# Altium schematic sheet 四缸机.SchDoc
size 459 x 379 mm
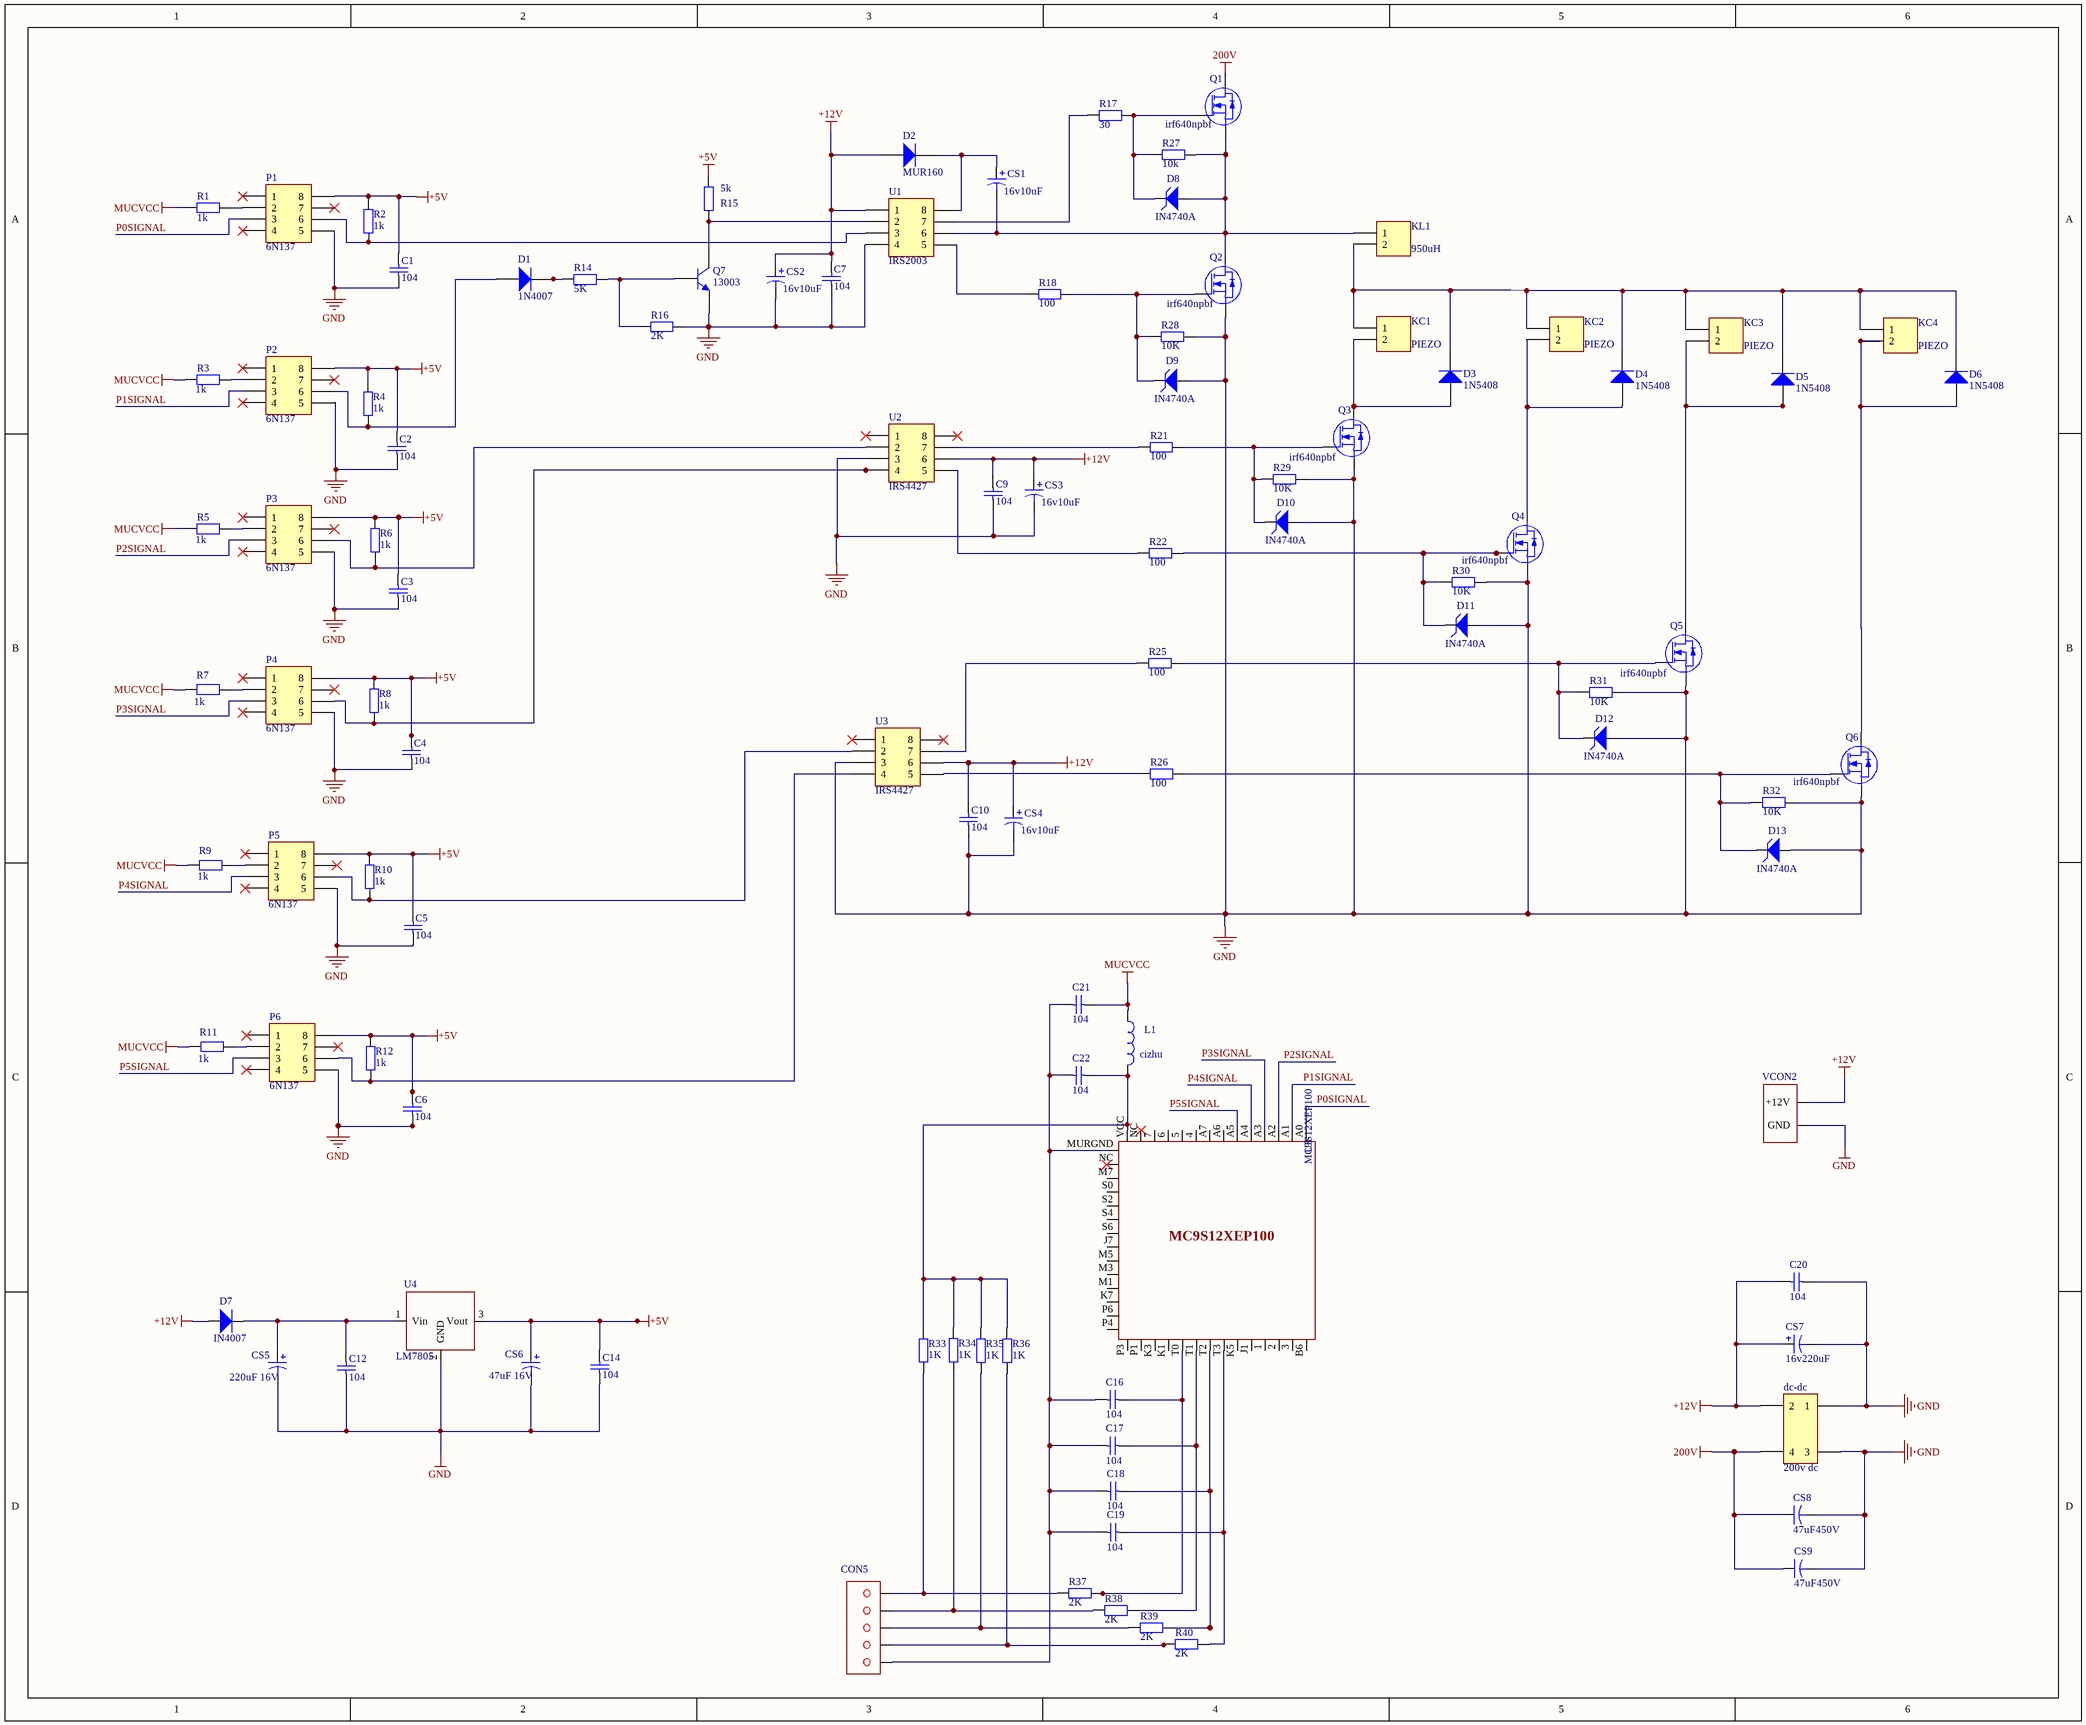
[diagram p0: 四缸机.SchDoc]

## Parts
C1  104  [RAD-0.1]
C2  104  [RAD-0.1]
C3  104  [RAD-0.1]
C4  104  [RAD-0.1]
C5  104  [RAD-0.1]
C6  104  [RAD-0.1]
C7  104  [RAD-0.1]
C9  104  [RAD-0.1]
C10  104  [RAD-0.1]
C12  104  [RAD-0.1]
C14  104  [RAD-0.1]
C16  104  [RAD-0.1]
C17  104  [RAD-0.1]
C18  104  [RAD-0.1]
C19  104  [RAD-0.1]
C20  104  [RAD-0.1]
C21  104  [RAD-0.1]
C22  104  [RAD-0.1]
CON5  *  [CON5]  (value not drawn)
CS1  16v10uF  [CAP 10uF 16V]
CS2  16v10uF  [CAP 10uF 16V]
CS3  16v10uF  [CAP 10uF 16V]
CS4  16v10uF  [CAP 10uF 16V]
CS5  220uF 16V  [CAP 220uF 16V]
CS6  47uF 16V  [CAP 47uF 16V]
CS7  16v220uF  [CAP 220uF 16V]
CS8  47uF450V  [47uF 450V]
CS9  47uF450V  [47uF 450V]
D1  1N4007  [DO-41]
D2  MUR160  [DO-41]
D3  1N5408  [DO-201AD]
D4  1N5408  [DO-201AD]
D5  1N5408  [DO-201AD]
D6  1N5408  [DO-201AD]
D7  IN4007  [IN4007]
D8  IN4740A  [IN4007]
D9  IN4740A  [IN4007]
D10  IN4740A  [IN4007]
D11  IN4740A  [IN4007]
D12  IN4740A  [IN4007]
D13  IN4740A  [IN4007]
dc-dc  200v dc  [DC12-200DC]
KC1  PIEZO  [Injection]
KC2  PIEZO  [Injection]
KC3  PIEZO  [Injection]
KC4  PIEZO  [Injection]
KL1  950uH  [VCON2 KL]
L1  cizhu  [cizhu]
P1  6N137  [DIP8X]
P2  6N137  [DIP8X]
P3  6N137  [DIP8X]
P4  6N137  [DIP8X]
P5  6N137  [DIP8X]
P6  6N137  [DIP8X]
Q1  irf640npbf  [TO-220AB]
Q2  irf640npbf  [TO-220AB]
Q3  irf640npbf  [TO-220AB]
Q4  irf640npbf  [TO-220AB]
Q5  irf640npbf  [TO-220AB]
Q6  irf640npbf  [TO-220AB]
Q7  13003  [GE TRANSLATE]
R1  1k  [AXIAL-0.4]
R2  1k  [AXIAL-0.4]
R3  1k  [AXIAL-0.4]
R4  1k  [AXIAL-0.4]
R5  1k  [AXIAL-0.4]
R6  1k  [AXIAL-0.4]
R7  1k  [AXIAL-0.4]
R8  1k  [AXIAL-0.4]
R9  1k  [AXIAL-0.4]
R10  1k  [AXIAL-0.4]
R11  1k  [AXIAL-0.4]
R12  1k  [AXIAL-0.4]
R14  5K  [AXIAL-0.4]
R15  5k  [AXIAL-0.4]
R16  2K  [AXIAL-0.4]
R17  30  [AXIAL-0.4]
R18  100  [AXIAL-0.4]
R21  100  [AXIAL-0.4]
R22  100  [AXIAL-0.4]
R25  100  [AXIAL-0.4]
R26  100  [AXIAL-0.4]
R27  10k  [AXIAL-0.4]
R28  10K  [AXIAL-0.4]
R29  10K  [AXIAL-0.4]
R30  10K  [AXIAL-0.4]
R31  10K  [AXIAL-0.4]
R32  10K  [AXIAL-0.4]
R33  1K  [AXIAL-0.4]
R34  1K  [AXIAL-0.4]
R35  1K  [AXIAL-0.4]
R36  1K  [AXIAL-0.4]
R37  2K  [AXIAL-0.4]
R38  2K  [AXIAL-0.4]
R39  2K  [AXIAL-0.4]
R40  2K  [AXIAL-0.4]
U1  IRS2003  [DIP8X]
U2  IRS4427  [DIP8X]
U3  IRS4427  [DIP8X]
U4  LM7805  [TO-220AB]
U5  MC9S12XEP100  [MC9S12XEP100]
VCON2  VCON2  [VCON2]

## Nets
200V: CS8.1 CS9.1 dc-dc.4 Q1.2(D)
+5V: C1.2 C2.2 C3.2 C4.2 C5.2 C6.2 C14.2 CS6.1 P1.8 P2.8 P3.8 P4.8 P5.8 P6.8 R2.2 R4.2 R6.2 R8.2 R10.2 R12.2 R15.2 U4.3(Vout)
+12V: C7.2 C9.2 C10.2 C20.2 CS2.1 CS3.1 CS4.1 CS7.1 D2.1(A) D7.1(A) dc-dc.2 U1.1 U2.6 U3.6 VCON2.1(+12V)
GND: C1.1 C2.1 C3.1 C4.1 C5.1 C6.1 C7.1 C9.1 C10.1 C12.1 C14.1 C20.1 CS2.2 CS3.2 CS4.2 CS5.2 CS6.2 CS7.2 CS8.2 CS9.2 D9.1(A) D10.1(A) D11.1(A) D12.1(A) D13.1(A) dc-dc.1 dc-dc.3 P1.5 P2.5 P3.5 P4.5 P5.5 P6.5 Q2.3(S) Q3.3(S) Q4.3(S) Q5.3(S) Q6.3(S) Q7.3(E) R16.2 R28.2 R29.2 R30.2 R31.2 R32.2 U1.4 U2.3 U3.3 U4.2(GND) VCON2.2(GND)
MUCVCC: C21.1 L1.2 R1.2 R3.2 R5.2 R7.2 R9.2 R11.2
P0SIGNAL: P1.3 U5.A0
P1SIGNAL: P2.3 U5.A1
P2SIGNAL: P3.3 U5.A2
P3SIGNAL: P4.3 U5.A3
P4SIGNAL: P5.3 U5.A4
P5SIGNAL: P6.3 U5.A5
NetC12_2: C12.2 CS5.1 D7.2(K) U4.1(Vin)
NetC16_1: C16.1 R37.2 U5.T0
NetC16_2: C16.2 C17.2 C18.2 C19.2 C21.2 C22.1 CON5.5 U5.MURGND
NetC17_1: C17.1 R38.2 U5.T1
NetC18_1: C18.1 R39.2 U5.T2
NetC19_1: C19.1 R40.2 U5.T3
NetC22_2: C22.2 L1.1 R33.2 R34.2 R35.2 R36.2 U5.VCC
NetCON5_1: CON5.1 R33.1 R37.1
NetCON5_2: CON5.2 R34.1 R38.1
NetCON5_3: CON5.3 R35.1 R39.1
NetCON5_4: CON5.4 R36.1 R40.1
NetCS1_1: CS1.1 D2.2(K) U1.8
NetCS1_2: CS1.2 D8.1(A) KL1.1 Q1.3(S) Q2.2(D) R27.2 U1.6
NetD1_1: D1.1(A) P2.6 R4.1
NetD1_2: D1.2(K) R14.1
NetD3_1: D3.1(A) KC1.2 Q3.2(D)
NetD3_2: D3.2(K) D4.2(K) D5.2(K) D6.2(K) KC1.1 KC2.1 KC3.1 KC4.1 KL1.2
NetD4_1: D4.1(A) KC2.2 Q4.2(D)
NetD5_1: D5.1(A) KC3.2 Q5.2(D)
NetD6_1: D6.1(A) KC4.2 Q6.2(D)
NetD8_2: D8.2(K) Q1.1(G) R17.2 R27.1
NetD9_2: D9.2(K) Q2.1(G) R18.2 R28.1
NetD10_2: D10.2(K) Q3.1(G) R21.2 R29.1
NetD11_2: D11.2(K) Q4.1(G) R22.2 R30.1
NetD12_2: D12.2(K) Q5.1(G) R25.2 R31.1
NetD13_2: D13.2(K) Q6.1(G) R26.2 R32.1
NetP1_2: P1.2 R1.1
NetP1_6: P1.6 R2.1 U1.3
NetP2_2: P2.2 R3.1
NetP3_2: P3.2 R5.1
NetP3_6: P3.6 R6.1 U2.2
NetP4_2: P4.2 R7.1
NetP4_6: P4.6 R8.1 U2.4
NetP5_2: P5.2 R9.1
NetP5_6: P5.6 R10.1 U3.2
NetP6_2: P6.2 R11.1
NetP6_6: P6.6 R12.1 U3.4
NetQ7_1: Q7.1(C) R15.1 U1.2
NetQ7_2: Q7.2(B) R14.2 R16.1
NetR17_1: R17.1 U1.7
NetR18_1: R18.1 U1.5
NetR21_1: R21.1 U2.7
NetR22_1: R22.1 U2.5
NetR25_1: R25.1 U3.7
NetR26_1: R26.1 U3.5

Not connected (* = marked no-connect by the designer): P1 1* 4* 7*; P2 1* 4* 7*; P3 1* 4* 7*; P4 1* 4* 7*; P5 1* 4* 7*; P6 1* 4* 7*; U2 1* 8*; U3 1* 8*; U5 1(39) 2(40) 3(41) 4(9) 5(10) 6(11) 7(12) A6(7) A7(8) B6(42) J1(38) J7(22) K1(32) K3(31) K5(37) K7(26) M1(25) M3(24) M5(23) M7(17) NC(13)* P1(30) P3(29) P4(28) P6(27) S0(18) S2(19) S4(20) S6(21)

## Library data of the parts
C1-C7 C9 C10 C12 C14 C16-C22 = CAP
CON5 = CON4
CS1-CS7 = CAP Source
CS8 CS9 = Cap2: Capacitor; Value: 100pF; Published: 23-Sep-2002; PackageReference: CAPR5-4X5; Publisher: Altium Limited; PackageDescription: Capacitor; 2 Leads
D1 D2 = Diode 1N4007: 1 Amp General Purpose Rectifier; Published: 8-Jun-2000; LatestRevisionDate: 17-Jul-2002; LatestRevisionNote: Re-released for DXP Platform.; DatasheetVersion: 1998; PackageReference: DO-41; Publisher: Altium Limited; PackageDescription: Diode, Axial; Body 5.2 x 2.7 mm (LxDia. max), Lead Dia. 0.86 mm (max); Code_JEDEC: DO-204-AL; ComponentLink1Description: Manufacturer Link; ComponentLink1URL: http://www.fairchildsemi.com/; ComponentLink2Description: Datasheet; ComponentLink2URL: http://www.fairchildsemi.com/ds/1N%2F1N4001.pdf; PackageVersion: Aug-1999
D3-D6 = Diode 1N5408: 3 Amp Medium Power Silicon Rectifier Diode; Published: 8-Jun-2000; LatestRevisionDate: 17-Jul-2002; LatestRevisionNote: Re-released for DXP Platform.; DatasheetVersion: Aug-1984; PackageReference: DO-201AD; Publisher: Altium Limited; PackageDescription: Diode, Axial; Body 9.5 x 5.3 mm (LxDia. max), Lead Dia. 1.32 mm (max); ComponentLink1Description: Manufacturer Link; ComponentLink1URL: http://www.irf.com/
D7 = Diode
D8-D13 = Diode WenYa
dc-dc = 12DC-200DC: DC-DC
KC1-KC4 KL1 = MHDR1X2: Header, 2-Pin; LatestRevisionDate: 17-Jul-2002; LatestRevisionNote: Re-released for DXP Platform.; Publisher: Altium Limited
P1-P6 U1-U3 = Header 4X2A: NOMDIP8; LatestRevisionDate: 17-Jul-2002; LatestRevisionNote: Re-released for DXP Platform.; Publisher: Altium Limited
Q1-Q6 = MOSFET_N
Q7 = QNPN: NPN Bipolar Transistor; Published: 8-Jun-2000; LatestRevisionDate: 29-May-2009; LatestRevisionNote: IPC-7351 Footprint Added.; PackageVersion: Aug-1999; PackageReference: SOT-23B; Publisher: Altium Limited; PackageDescription: 3-Pin SOT-23 Package 0.95 mm Pitch, 2.4 mm Lead Span
R1-R12 R33-R36 = Res2: Resistor; Published: 8-Jun-2000; LatestRevisionDate: 17-Jul-2002; LatestRevisionNote: Re-released for DXP Platform.; PackageReference: AXIAL-0.4; Publisher: Altium Limited; PackageDescription: Axial Device, Thru-Hole; 2 Leads; 0.4 in Pin Spacing; Value: 1K
R14-R18 R21 R22 R25-R32 R37-R40 = Res2: Resistor; Value: 1K; Published: 8-Jun-2000; LatestRevisionDate: 17-Jul-2002; LatestRevisionNote: Re-released for DXP Platform.; PackageReference: AXIAL-0.4; Publisher: Altium Limited; PackageDescription: Axial Device, Thru-Hole; 2 Leads; 0.4 in Pin Spacing
U5 = MC9S12XEP00
VCON2 = VCON3